# EAGLE design bluc_r3 (EAGLE 6.5.0)
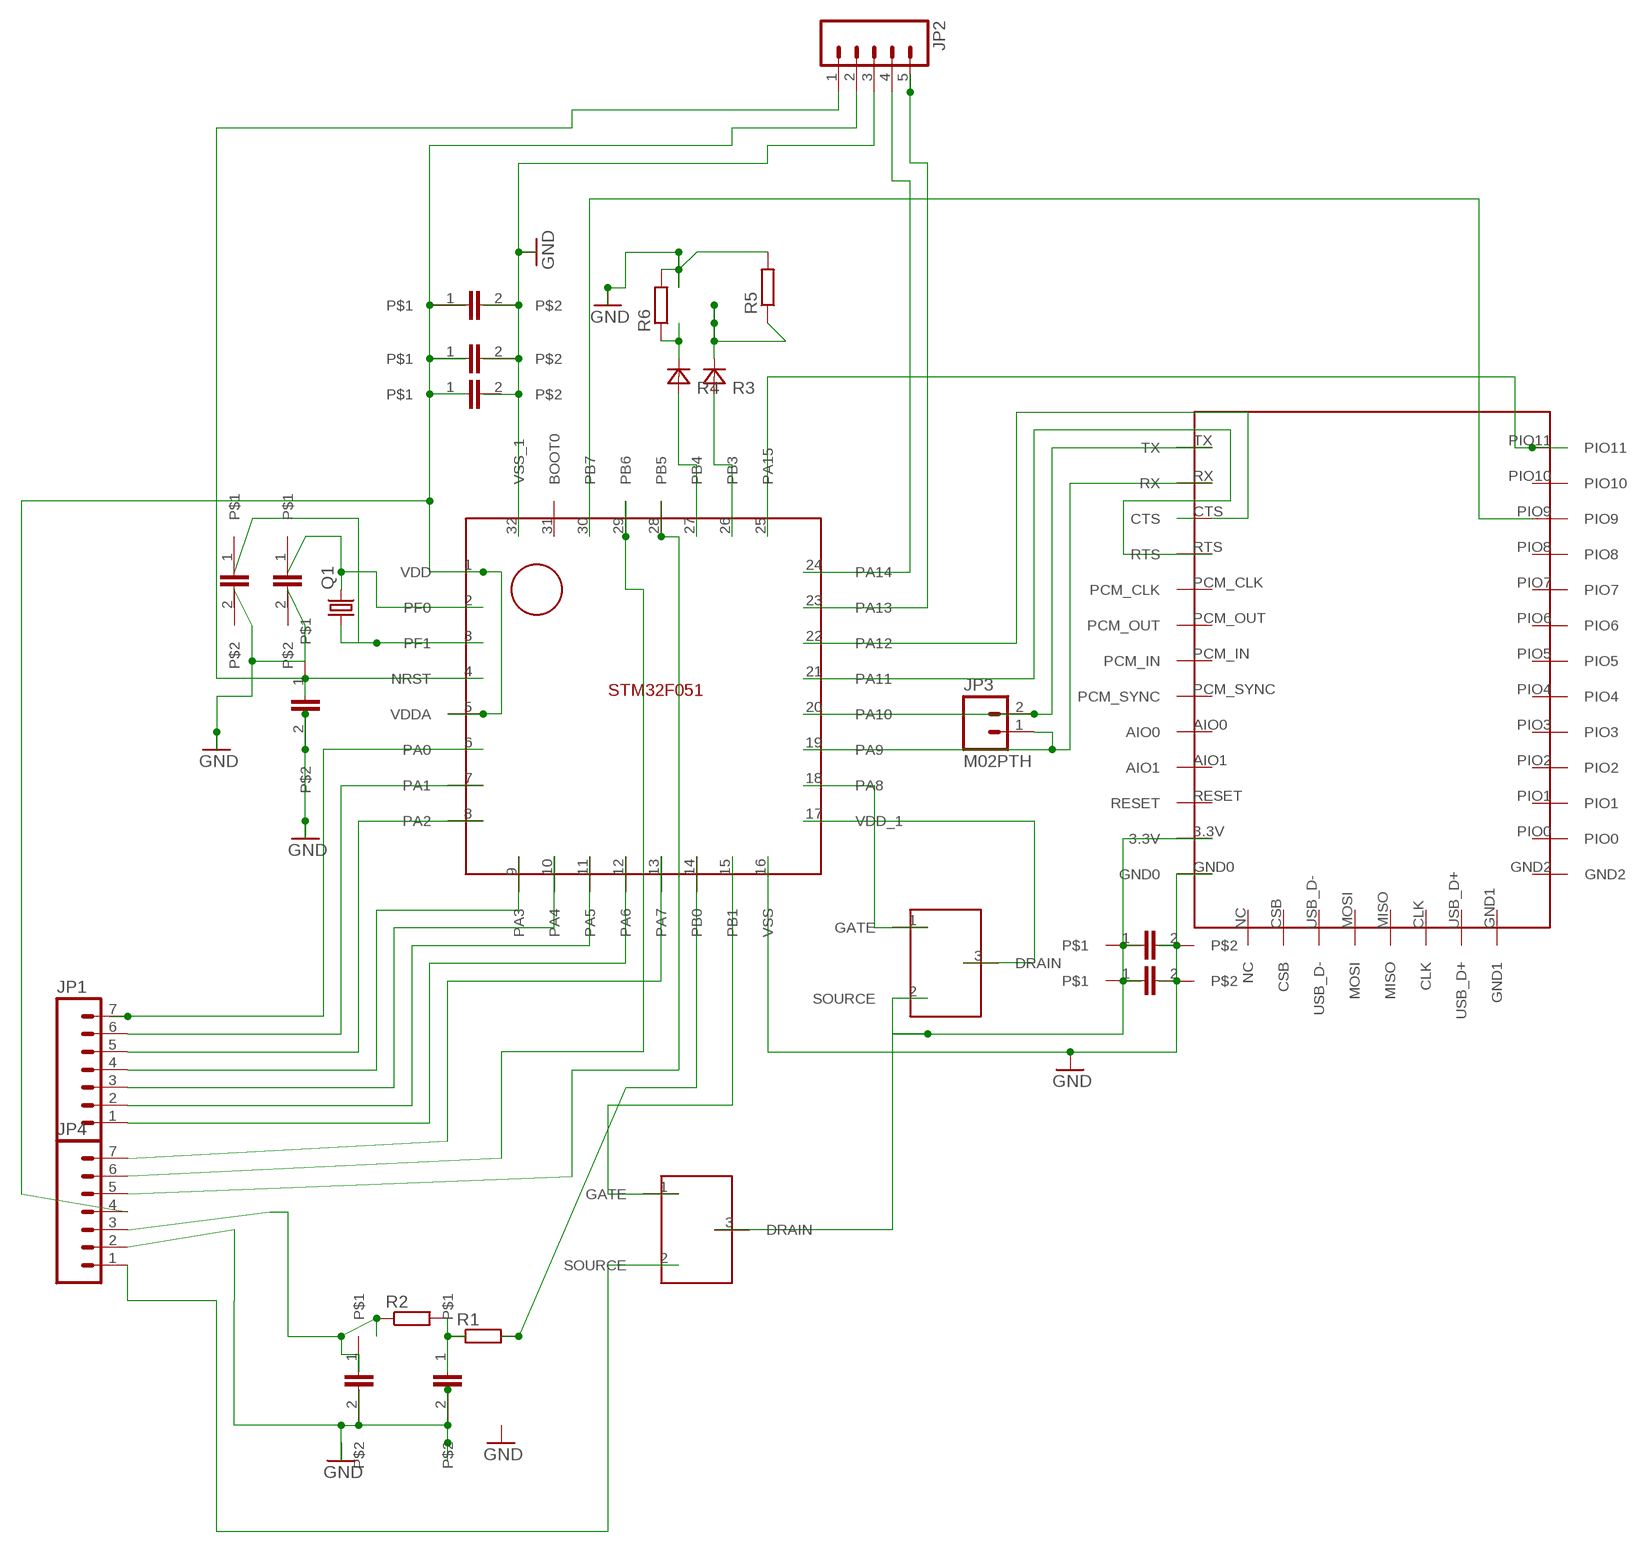
[diagram p0: schematic, sheet 1]

## Parts
JP1  M07  [1X07]
JP2  M05PTH  [1X05]
JP3  M02PTH  [1X02]
JP4  M07  [1X07]
Q1  CRYSTAL  [32768_CRYSTAL_PACKAGE]
R1  R-EU_R0603  [R0603]
R2  R-EU_R0603  [R0603]
R3  DIODE  [C0805K]
R4  DIODE  [C0805K]
R5  R-EU_R0603  [R0603]
R6  R-EU_R0603  [R0603]
U$1  STM32F051  [LQFP32-7X7]
U$2  HC-05  [HC-05]
U$3  2N7002K  [SOT23]
U$4  2N7002K  [SOT23]
U$5  C0.1UF  [C0805K]
U$6  C0.1UF  [C0805K]
U$7  C0.1UF  [C0805K]
U$8  C0.1UF  [C0805K]
U$9  C0.1UF  [C0805K]
U$10  C0.1UF  [C0805K]
U$11  C1UF  [C0805K]
U$12  C1UF  [C0805K]
U$13  C0.1UF  [C0805K]
U$14  C0.1UF  [C0805K]

## Nets
GND: JP2.3 JP4.2 R5.2 R6.2 U$1.16(VSS) U$1.32(VSS_1) U$2.GND0 U$5.2 U$6.2 U$7.2 U$8.2 U$9.2 U$10.2 U$11.2 U$12.2 U$13.2 U$14.2
N$1: JP3.2 U$1.20(PA10) U$2.TX
N$2: JP3.1 U$1.19(PA9) U$2.RX
N$3: U$1.21(PA11) U$2.RTS
N$4: U$1.22(PA12) U$2.CTS
N$6: U$1.25(PA15) U$2.PIO11
N$7: U$1.18(PA8) U$3.1(GATE)
N$8: U$1.17(VDD_1) U$3.3(DRAIN)
N$9: JP1.7 U$1.6(PA0)
N$10: U$2.3.3V U$3.2(SOURCE) U$4.3(DRAIN) U$5.1 U$6.1
N$11: JP2.5 U$1.23(PA13)
N$12: JP2.4 U$1.24(PA14)
N$13: JP2.1 U$1.4(NRST) U$10.1
N$14: JP1.6 U$1.7(PA1)
N$15: JP2.2 JP4.4 U$1.1(VDD) U$1.5(VDDA) U$7.1 U$8.1 U$9.1
N$16: JP1.5 U$1.8(PA2)
N$17: U$1.15(PB1) U$4.1(GATE)
N$19: R1.1 R2.2 U$11.1
N$20: JP1.4 U$1.9(PA3)
N$21: R1.2 U$1.14(PB0)
N$22: JP4.3 R2.1 U$12.1
N$23: JP1.3 U$1.10(PA4)
N$24: JP1.2 U$1.11(PA5)
N$25: JP1.1 U$1.12(PA6)
N$26: JP4.7 U$1.13(PA7)
N$28: JP4.1 U$4.2(SOURCE)
N$29: R4.1(A) R6.1
N$30: JP4.5 U$1.28(PB5)
N$31: JP4.6 U$1.29(PB6)
N$32: Q1.1 U$1.3(PF1) U$14.1
N$33: Q1.4 U$1.2(PF0) U$13.1
N$35: R4.2(C) U$1.27(PB4)
N$36: R3.2(C) U$1.26(PB3)
N$37: R3.1(A) R5.1
N$38: U$1.30(PB7) U$2.PIO9
Unconnected: U$1.31(BOOT0) U$2.AIO0 U$2.AIO1 U$2.CLK U$2.CSB U$2.GND1 U$2.GND2 U$2.MISO U$2.MOSI U$2.NC U$2.PCM_CLK U$2.PCM_IN U$2.PCM_OUT U$2.PCM_SYNC U$2.PIO0 U$2.PIO1 U$2.PIO2 U$2.PIO3 U$2.PIO4 U$2.PIO5 U$2.PIO6 U$2.PIO7 U$2.PIO8 U$2.PIO10 U$2.RESET U$2.USB_D+ U$2.USB_D-

## Library data of the parts
JP1 JP4 = SparkFun-Connectors:M07: Header 7 Standard 7-pin 0.1" header. Use with straight break away headers (SKU : PRT-00116), right angle break away headers (PRT-00553), swiss pins (PRT-00743), machine pins (PRT-00117), and female headers (PRT-00115). NOTES ON THE VARIANTS LOCK and LOCK_LONGPADS... This footprint was designed to help hold the alignment of a through-hole component (i.e. 7-pin header) while soldering it into place. You may notice that each hole has been shifted either up or down by 0.005 of an inch from it's more standard position (which is usually a perfectly straight line). This slight alteration caused the pins (the squares in the middle) to touch the edges of the holes. Because they are alternating, it causes a "brace" to hold the header in place. 0.005 has proven to be the perfect amount of "off-center" position when using our standard breakaway headers. Although looks a little odd when you look at the bare footprint, once you have a header in there, the alteration is very hard to notice. Also, if you push a header all the way into place, it is covered up entirely on the bottom side. This idea of altering the position of holes to aid alignment will be further integrated into the Sparkfun Library for other footprints. It can help hold any component with 3 or more connection pins.
JP2 = SparkFun-Connectors:M05: Header 5 Standard 5-pin 0.1" header. Use with straight break away headers (SKU : PRT-00116), right angle break away headers (PRT-00553), swiss pins (PRT-00743), machine pins (PRT-00117), and female headers (PRT-00115). Molex polarized connector foot print use with SKU : PRT-08230 with associated crimp pins and housings.
JP3 = SparkFun-Connectors:M02: Standard 2-pin 0.1" header. Use with - straight break away headers ( PRT-00116) - right angle break away headers (PRT-00553) - swiss pins (PRT-00743) - machine pins (PRT-00117) - female headers (PRT-00115) Molex polarized connector foot print use with: PRT-08233 with associated crimp pins and housings. 2.54_SCREWTERM for use with PRT-10571. 3.5mm Screw Terminal footprints for PRT-08084 5mm Screw Terminal footprints for use with PRT-08433
Q1 = bluec:CRYSTAL: CRYSTAL
R1 R2 R5 R6 = bluec:R-EU_: RESISTOR, European symbol
R3 R4 = bluec:DIODE: Diode
U$1 = bluec:STM32F051
U$2 = bluec:HC-05
U$3 U$4 = bluec:2N7002K
U$5-U$10 U$13 U$14 = bluec:C0.1UF
U$11 U$12 = bluec:C1UF

## Board
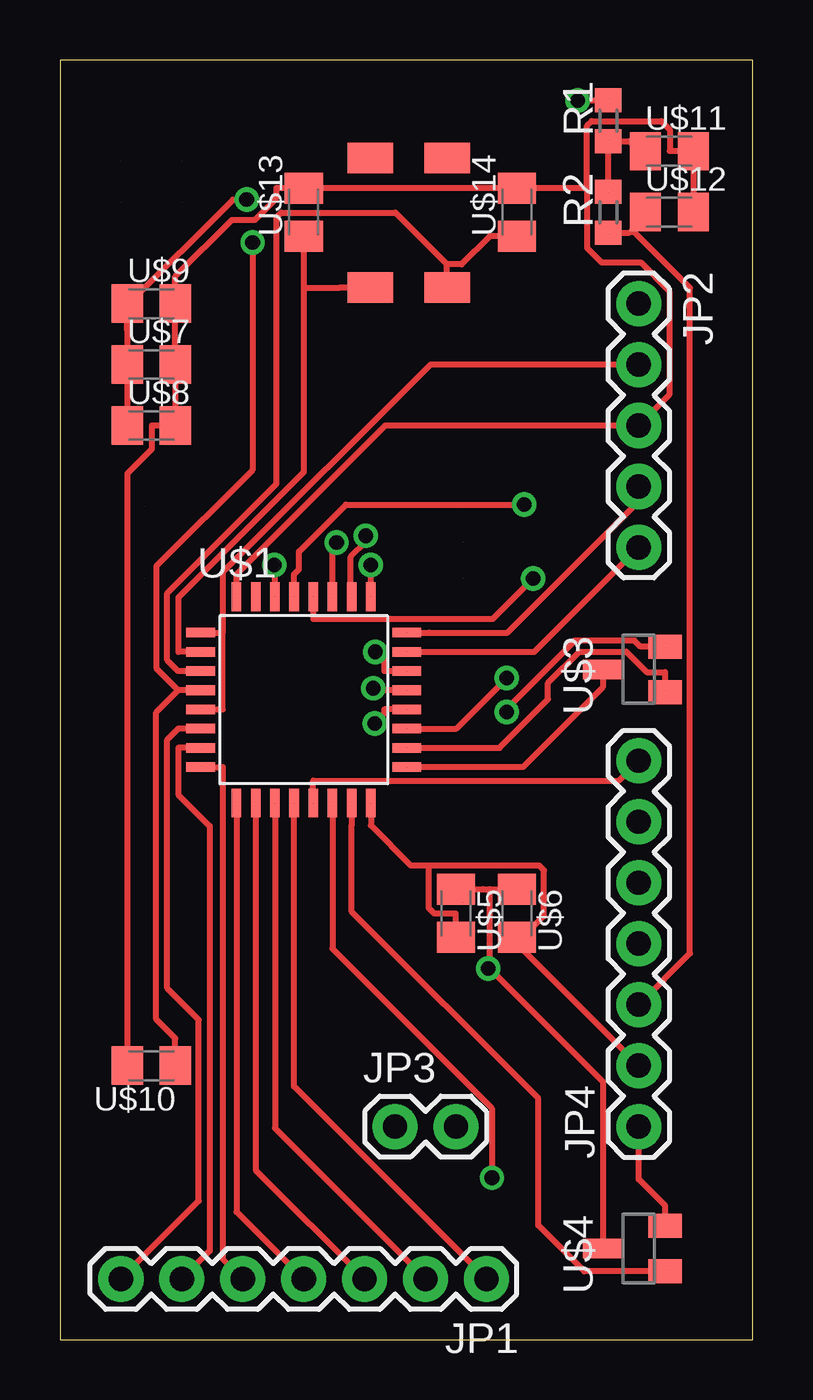
[diagram p1: board, top side]
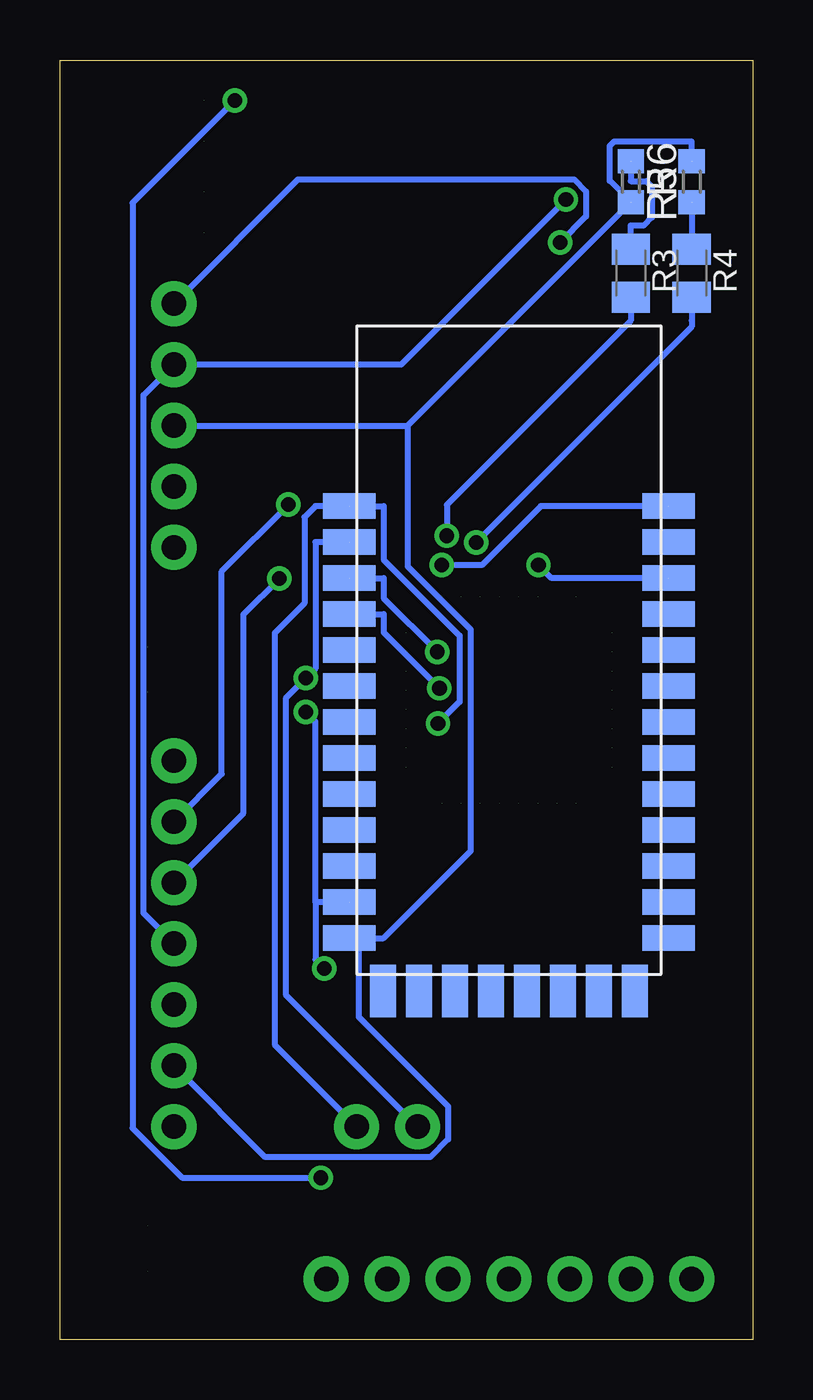
[diagram p2: board, bottom side, seen from below]

Size 28.88 x 53.33 mm. Coordinates in mm from the lower left corner, seen from the top.
Outline: 0,0 28.88,0 28.88,53.33 0,53.33 0,0
Copper layers (1*16): Top 0.035mm / dielectric 1.5mm / Bottom 0.035mm
Design rules "default *": minimum track width 10mil, minimum drill 24mil, track to track 7mil, track to pad 8mil, pad to pad 8mil, via to via 8mil, smd to smd 8mil, copper to edge 40mil, drill to drill 8mil, minimum pad ring 10mil, minimum via ring 8mil, stop-mask expansion 4mil, vias tented up to drill 0mil, thermal gap 10mil

### Footprints (pad centres in the part's own frame; a part is rotated, then mirrored left to right if it is on the bottom)
1X07 = drill 1.016 pad 1.88: 1 0,0; 2 2.54,0; 3 5.08,0; 4 7.62,0; 5 10.16,0; 6 12.7,0; 7 15.24,0
1X05 = drill 1.016 pad 1.88: 1 0,0; 2 2.54,0; 3 5.08,0; 4 7.62,0; 5 10.16,0
1X02 = drill 1.016 pad 1.88: 1 0,0; 2 2.54,0
32768_CRYSTAL_PACKAGE = smd 1.27 x 1.9: 1 -0.6,-0.9; 2 4.8,-0.9; 3 4.8,2.3; 4 -0.6,2.3
R0603 = smd 1 x 1.1: 1 -0.85,0; 2 0.85,0
C0805K = smd 1.3 x 1.6: 1 -1,0; 2 1,0
LQFP32-7X7 = smd 1.2 x 0.4: 1 -4.3,2.8; 2 -4.3,2; 3 -4.3,1.2; 4 -4.3,0.4; 5 -4.3,-0.4; 6 -4.3,-1.2; 7 -4.3,-2; 8 -4.3,-2.8; 17 4.3,-2.8; 18 4.3,-2; 19 4.3,-1.2; 20 4.3,-0.4; 21 4.3,0.4; 22 4.3,1.2; 23 4.3,2; 24 4.3,2.8 | smd 0.4 x 1.2: 9 -2.8,-4.3; 10 -2,-4.3; 11 -1.2,-4.3; 12 -0.4,-4.3; 13 0.4,-4.3; 14 1.2,-4.3; 15 2,-4.3; 16 2.8,-4.3; 25 2.8,4.3; 26 2,4.3; 27 1.2,4.3; 28 0.4,4.3; 29 -0.4,4.3; 30 -1.2,4.3; 31 -2,4.3; 32 -2.8,4.3
HC-05 = smd 2.184 x 1.067: 3.3V -0.3,3; AIO0 -0.3,7.5; AIO1 -0.3,6; CTS -0.3,16.5; GND0 -0.3,1.5; GND2 13,1.5; PCM_CLK -0.3,13.5; PCM_IN -0.3,10.5; PCM_OUT -0.3,12; PCM_SYNC -0.3,9; PIO0 13,3; PIO1 13,4.5; PIO2 13,6; PIO3 13,7.5; PIO4 13,9; PIO5 13,10.5; PIO6 13,12; PIO7 13,13.5; PIO8 13,15; PIO9 13,16.5; PIO10 13,18; PIO11 13,19.5; RESET -0.3,4.5; RTS -0.3,15; RX -0.3,18; TX -0.3,19.5 | smd 1.067 x 2.184: CLK 8.6,-0.7; CSB 4.1,-0.7; GND1 11.6,-0.7; MISO 7.1,-0.7; MOSI 5.6,-0.7; NC 1.1,-0.7; USB_D+ 10.1,-0.7; USB_D- 2.6,-0.7
SOT23 = smd 1 x 1.4: 1 -0.95,-1.1; 2 0.95,-1.1 | smd 0.813 x 1.676: 3 0,1.5

### Placement (x,y rotation side)
JP1  17.78,2.54 180 top
JP2  24.13,43.18 270 top
JP3  13.97,8.89 0 top
JP4  24.13,8.89 90 top
Q1  15.24,44.45 90 top
R1  22.86,50.8 90 top
R2  22.86,46.99 90 top
R3  5.08,44.45 270 bottom
R4  2.54,44.45 270 bottom
R5  5.08,48.26 270 bottom
R6  2.54,48.26 90 bottom
U$1  10.16,26.67 0 top
U$2  16.51,15.24 0 bottom
U$3  24.13,27.94 90 top
U$4  24.13,3.81 90 top
U$5  16.51,17.78 270 top
U$6  19.05,17.78 270 top
U$7  3.81,40.64 0 top
U$8  3.81,38.1 0 top
U$9  3.81,43.18 0 top
U$10  3.81,11.43 180 top
U$11  25.4,49.53 0 top
U$12  25.4,46.99 0 top
U$13  10.16,46.99 90 top
U$14  19.05,46.99 90 top

### Tracks (layer width: path | path; a pad name or v marks a point on that pad's centre or on a via)
GND  (4 unrouted)
  Top 0.254: 21.98,47.99 21.98,45.5 22.58,44.9 24.21,44.9 25.41,43.7 25.41,39.38 JP2.3 13.56,38.1 7.36,31.9 U$1.32 | JP4.2 19.05,16.51 19.05,16.54 | 21.98,47.99 U$14.2 U$13.2 9.03,47.99 9.03,47.57 8.13,46.67 7.17,46.67 4.81,44.31 U$9.2 U$7.2 U$8.2 3.83,38.1 3.83,37.12 2.81,36.1 U$10.2 | 15.38,19.77 14.63,19.77 12.96,21.44 U$1.16 | 19.05,16.54 20.18,17.67 20.18,19.57 19.99,19.77 15.38,19.77 | 15.38,19.77 15.38,17.99 15.61,17.76 16.51,17.76 U$5.2 | U$6.2 19.05,16.54 | 21.98,47.99 21.98,50.58 22.17,50.78 25.07,50.78 25.42,50.43 25.42,49.53 U$11.2 U$12.2
  Bottom 0.254: 14.39,38.1 14.39,32.23 11.76,29.61 11.76,20.36 15.39,16.74 16.43,16.74 | 16.43,16.74 16.43,13.46 12.7,9.73 12.7,8.36 13.44,7.62 20.32,7.62 JP4.2 | U$2.GND0 16.43,16.74 | 14.39,38.1 R5.2 5.96,48.29 5.96,49.75 5.77,49.94 2.54,49.94 R6.2 | JP2.3 14.39,38.1
N$1  (via drill 0.61 pad 1.02)  (2 unrouted)
  Top 0.254: v13.12,25.69 13.53,26.1 13.53,26.27 U$1.20
  Bottom 0.254: JP3.2 19.93,12.31 19.93,29.45 18.69,30.69 18.69,34.28 18.23,34.74 U$2.TX 16.1,34.74 15.39,34.74 15.39,32.51 12.22,29.34 12.22,26.59 v13.12,25.69
N$2  (via drill 0.61 pad 1.02)  (2 unrouted)
  Top 0.254: U$1.19 16.52,25.47 v18.63,27.58
  Bottom 0.254: JP3.1 19.47,14.39 19.47,26.74 v18.63,27.58 18.23,27.97 18.23,33.24 U$2.RX
N$3  (via drill 0.61 pad 1.02)  (1 unrouted)
  Top 0.254: v13.06,27.15 13.45,27.15 13.53,27.07 U$1.21
  Bottom 0.254: v13.06,27.15 15.39,29.48 15.39,30.24 U$2.RTS
N$4  (via drill 0.61 pad 1.02)  (2 unrouted)
  Top 0.254: v13.15,28.67 13.53,28.29 13.53,27.87 U$1.22
  Bottom 0.254: U$2.CTS 15.39,31.74 15.39,30.91 v13.15,28.67
N$6  (via drill 0.61 pad 1.02)  (2 unrouted)
  Top 0.254: v12.96,32.28 12.96,31.9 U$1.25
  Bottom 0.254: U$2.PIO11 8.83,34.74 11.29,32.28 v12.96,32.28
N$7  (2 unrouted)
  Top 0.254: U$1.18 18.32,24.67 20.35,26.7 20.35,27.37 21.65,28.68 23.61,28.68 24.46,27.82 25.23,27.82 U$3.1
N$8  (1 unrouted)
  Top 0.254: U$3.3 22.63,27.2 19.3,23.87 U$1.17
N$9  (1 unrouted)
  Top 0.254: JP1.7 5.79,5.79 5.79,13.34 4.47,14.66 4.47,25.01 4.93,25.47 U$1.6
N$10  (via drill 0.61 pad 1.02)  (2 unrouted)
  Top 0.254: v18.63,26.16 18.63,26.3 21.46,29.14 23.95,29.14 24.2,28.89 U$3.2 | 17.92,15.48 v17.86,15.48 | 17.92,15.48 22.63,10.77 U$4.3 | 17.92,18.78 17.92,15.48 | 17.92,18.78 U$6.1 | 17.92,18.78 17.64,18.78 U$5.1
  Bottom 0.254: 18.23,18.24 18.23,25.77 v18.63,26.16 | 18.23,18.24 18.23,15.86 v17.86,15.48 | U$2.3.3V 18.23,18.24
N$11  (1 unrouted)
  Top 0.254: U$1.23 19.78,28.67 JP2.5
N$12  (1 unrouted)
  Top 0.254: JP2.4 24.13,34.94 18.66,29.47 15.39,29.47 U$1.24
N$13  (via drill 0.61 pad 1.02)  (1 unrouted)
  Top 0.254: v8.03,45.73 8.03,36.25 4.01,32.23 4.01,27.99 4.93,27.07 | U$1.4 4.93,27.07 | 4.93,27.07 4.01,26.15 4.01,13.36 4.81,12.56 U$10.1
  Bottom 0.254: JP2.1 18.95,48.36 7.44,48.36 6.94,47.86 6.94,46.81 v8.03,45.73
N$14  (1 unrouted)
  Top 0.254: JP1.6 6.25,3.71 6.25,21.41 4.93,22.72 4.93,24.67 U$1.7
N$15  (via drill 0.61 pad 1.02)  (2 unrouted)
  Top 0.254: JP2.2 15.45,40.64 6.79,31.98 6.79,29.47 | U$1.5 6.79,26.27 6.79,29.47 | U$1.1 6.79,29.47 | 2.81,42.05 U$7.1 U$8.1 | U$9.1 2.81,42.05 | 2.81,42.05 2.81,43.1 7.22,47.51 v7.78,47.51
  Bottom 0.254: v7.78,47.51 14.65,40.64 JP2.2 25.4,39.37 25.4,17.78 JP4.4
N$16  (1 unrouted)
  Top 0.254: U$1.8 6.79,23.87 6.79,3.37 JP1.5
N$17  (2 unrouted)
  Top 0.254: U$4.1 21.86,2.86 19.95,4.78 19.95,10.06 12.16,17.85 12.16,21.44 U$1.15
N$19  (2 unrouted)
  Top 0.254: U$11.1 24.16,49.53 23.74,49.95 R1.1 R2.2
N$20  (1 unrouted)
  Top 0.254: U$1.9 7.36,5.34 JP1.4
N$21  (via drill 0.61 pad 1.02)  (2 unrouted)
  Top 0.254: U$1.14 11.36,16.3 18.01,9.65 v18.01,6.76 | v21.59,51.65 R1.2
  Bottom 0.254: v21.59,51.65 25.86,47.38 25.86,8.82 23.8,6.76 v18.01,6.76
N$22  (1 unrouted)
  Top 0.254: 23.96,46.14 23.74,46.14 R2.1 | JP4.3 26.27,16.11 26.27,43.83 23.96,46.14 | 23.96,46.14 23.96,46.99 U$12.1
N$23  (1 unrouted)
  Top 0.254: U$1.10 8.16,7.08 JP1.3
N$24  (1 unrouted)
  Top 0.254: U$1.11 8.96,8.82 JP1.2
N$25  (1 unrouted)
  Top 0.254: JP1.1 9.76,10.56 U$1.12
N$26  (1 unrouted)
  Top 0.254: U$1.13 10.56,23.3 23.3,23.3 JP4.7
N$28  (1 unrouted)
  Top 0.254: U$4.2 25.23,5.59 24.13,6.69 JP4.1
N$29  (1 unrouted)
  Bottom 0.254: R6.1 R4.1
N$30  (via drill 0.61 pad 1.02)  (1 unrouted)
  Top 0.254: v19.73,31.72 18.05,30.04 10.56,30.04 U$1.28
  Bottom 0.254: JP4.5 21.23,21.95 | 21.23,21.95 | 21.23,21.95 21.23,30.23 v19.73,31.72
N$31  (via drill 0.61 pad 1.02)  (1 unrouted)
  Top 0.254: v19.36,34.8 11.92,34.8 9.96,32.85 9.96,32.1 9.76,31.9 U$1.29
  Bottom 0.254: JP4.6 22.14,23.58 22.14,32.02 v19.36,34.8
N$32  (1 unrouted)
  Top 0.254: U$1.3 4.93,27.87 4.47,28.33 4.47,31.12 9.03,35.67 9.03,46.78 9.22,46.97 13.98,46.97 16.14,44.81 | Q1.1 16.14,44.81 | U$14.1 17.92,45.99 16.75,44.81 16.14,44.81
N$33  (1 unrouted)
  Top 0.254: U$1.2 4.93,28.67 4.93,30.93 10.16,36.16 10.16,43.85 | U$13.1 10.16,43.85 | 10.16,43.85 11.66,43.85 Q1.4
N$35  (via drill 0.61 pad 1.02)  (1 unrouted)
  Top 0.254: v11.53,33.23 11.36,33.05 11.36,31.9 U$1.27
  Bottom 0.254: v11.53,33.23 2.54,42.22 2.54,42.47 R4.2
N$36  (via drill 0.61 pad 1.02)  (1 unrouted)
  Top 0.254: U$1.26 12.12,31.01 12.12,32.63 12.75,33.26 v12.75,33.51
  Bottom 0.254: v12.75,33.51 12.75,34.8 5.08,42.47 R3.2 | v12.75,33.51
N$37  (1 unrouted)
  Bottom 0.254: R5.1 5.08,48.28 4.43,48.28 4.2,48.05 4.2,46.77 4.54,46.43 5.08,46.43 R3.1
N$38  (via drill 0.61 pad 1.02)  (2 unrouted)
  Top 0.254: U$1.30 8.96,32.26 v8.93,32.29
  Bottom 0.254: U$2.PIO9 8.39,31.74 v8.93,32.29